# Altium project MiniGateway4G.PrjPcb
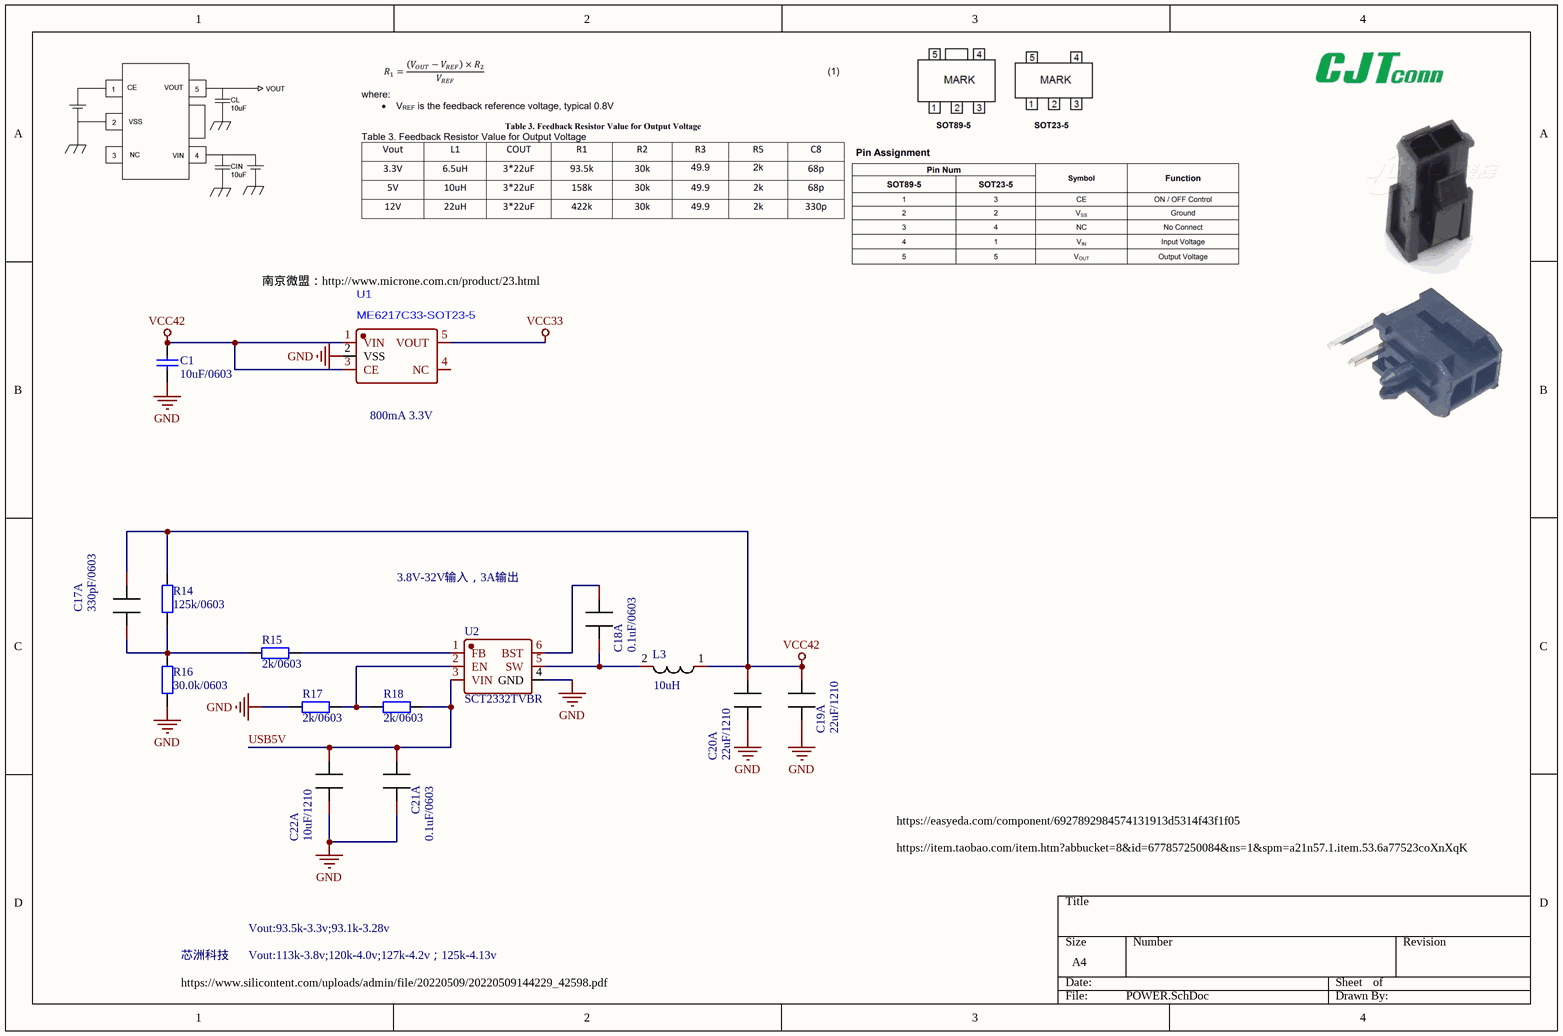
[diagram p0: POWER.SchDoc]
5 sheets, 71 parts. Net scope: global (net labels, ports and power ports of the same name join across sheets).
Board file: MiniGateway4G0409.PcbDoc
Sheets:
  POWER.SchDoc
  My4G.SchDoc
  RS485.SchDoc
  CANBUS.SchDoc
  MCU.SchDoc

## Sheet POWER.SchDoc
size A4; SheetNumber: 1; SheetTotal: 5

### Parts
C1  10uF/0603  [CAP0603]
C17  330pF/0603  [CAP0603]  (part A of 4)
C18  0.1uF/0603  [CAP0603]  (part A of 4)
C19  22uF/1210  [CAP0603]  (part A of 4)
C20  22uF/1210  [CAP1210-CAPC3225X140N]  (part A of 4)
C21  0.1uF/0603  [CAP0603]  (part A of 4)
C22  10uF/1210  [CAP1210-CAPC3225X140N]  (part A of 4)
L3  10uH  [IND-SMD_L4.7-W4.7-6.5uH]
R14  125k/0603  [RES0603]
R15  2k/0603  [RES0603]
R16  30.0k/0603  [RES0603]
R17  2k/0603  [RES0603]
R18  2k/0603  [RES0603]
U1  ME6217C33-SOT23-5  [ME6217C33-SOT23-5]
U2  SCT2332TVBR  [SCT2332TVBR-TSOT23-6]

### Nets
GND: C1.1 C19.2 C20.2 C21.2 C22.2 R16.2 R17.2 U1.2(VSS) U2.4(GND)
VCC33: U1.5(VOUT)
VCC42: C1.2 C17.1 C19.1 C20.1 L3.1 R14.1 U1.1(VIN) U1.3(CE)
USB5V: C21.1 C22.1 R18.1 U2.3(VIN)
NetC17_2: C17.2 R14.2 R15.2 R16.1
NetC18_1: C18.1 U2.6(BST)
NetC18_2: C18.2 L3.2 U2.5(SW)
NetR15_1: R15.1 U2.1(FB)
NetR17_1: R17.1 R18.2 U2.2(EN)

Not connected (* = marked no-connect by the designer): U1 4(NC)

### Notes on the sheet
- 南京微盟：http://www.microne.com.cn/product/23.html
- (near U1) 800mA 3.3V
- 3.8V-32V输入，3A输出
- https://item.taobao.com/item.htm?abbucket=8&id=677857250084&ns=1&spm=a21n57.1.item.53.6a77523coXnXqK
- https://easyeda.com/component/6927892984574131913d5314f43f1f05
- 芯洲科技
- https://www.silicontent.com/uploads/admin/file/20220509/20220509144229_42598.pdf
- Vout:113k-3.8v;120k-4.0v;127k-4.2v；125k-4.13v
- Vout:93.5k-3.3v;93.1k-3.28v

### Library data of the parts
C1 = Cap Semi: Capacitor (Semiconductor SIM Model); Value: 10uf; Published: 8-Jun-2000; LatestRevisionDate: 29-May-2009; LatestRevisionNote: IPC-7351 Footprint Added.; PackageReference: C1206; Publisher: Altium Limited; PackageDescription: Chip Capacitor
C17 = CAP0603: SURFACE MOUNT CAPACITOR 0.031 X 0.061 INCHES; Manufacturer #1: IPC SM-782 STD.; Sim_Analog_Order: Model$; Value: 330pF/0603/25V; PCB DECAL: 0603; Add into BOM: yes; Name: CAP0603; Symbol: CAP0603; Device: CAP0603; OldName: CAP0603; Convert to PCB: yes; Origin Footprint: 0603
C18 C19 C21 = CAP0603: SURFACE MOUNT CAPACITOR 0.031 X 0.061 INCHES; Manufacturer #1: IPC SM-782 STD.; Sim_Analog_Order: Model$; Value: 0.1uF/0603/50V; PCB DECAL: 0603; Add into BOM: yes; Name: CAP0603; Symbol: CAP0603; Device: CAP0603; OldName: CAP0603; Convert to PCB: yes; Origin Footprint: 0603
C20 = CAP0603: SURFACE MOUNT CAPACITOR 0.031 X 0.061 INCHES; Manufacturer #1: IPC SM-782 STD.; Sim_Analog_Order: Model$; Value: 22uF/1210/35V; PCB DECAL: 0603; Add into BOM: yes; Name: CAP0603; Symbol: CAP0603; Device: CAP0603; OldName: CAP0603; Convert to PCB: yes; Origin Footprint: 0603
C22 = CAP0603: SURFACE MOUNT CAPACITOR 0.031 X 0.061 INCHES; Manufacturer #1: IPC SM-782 STD.; Sim_Analog_Order: Model$; Value: 10uF/1210/35V; PCB DECAL: 0603; Add into BOM: yes; Name: CAP0603; Symbol: CAP0603; Device: CAP0603; OldName: CAP0603; Convert to PCB: yes; Origin Footprint: 0603
L3 = IND-MOLDED: 0503贴片电感; Sim_Analog_Order: Model$; Sim_Analog_Prefix: L; Description" MOLDED INDUCTOR, 0_5: PIN SPACING; PCB DECAL: L_0650; Add into BOM: yes; Name: IND-MOLDED; Symbol: IND-MOLDED; Device: IND-MOLDED; OldName: IND-MOLDED; Value: 10uH; Convert to PCB: yes; Origin Footprint: L_0650
R14-R18 = Res2: Resistor; Published: 8-Jun-2000; LatestRevisionDate: 17-Jul-2002; LatestRevisionNote: Re-released for DXP Platform.; PackageReference: AXIAL-0.4; Publisher: Altium Limited; PackageDescription: Axial Device, Thru-Hole; 2 Leads; 0.4 in Pin Spacing
U1 = ME6217C33M5G: 4.2v-3.3v LDO
U2 = SCT2332TVBR: 3.8V-32V Vin, 3A Synchronous Step-down DCDC Converter

## Sheet My4G.SchDoc
size A3; SheetNumber: 2; SheetTotal: 5
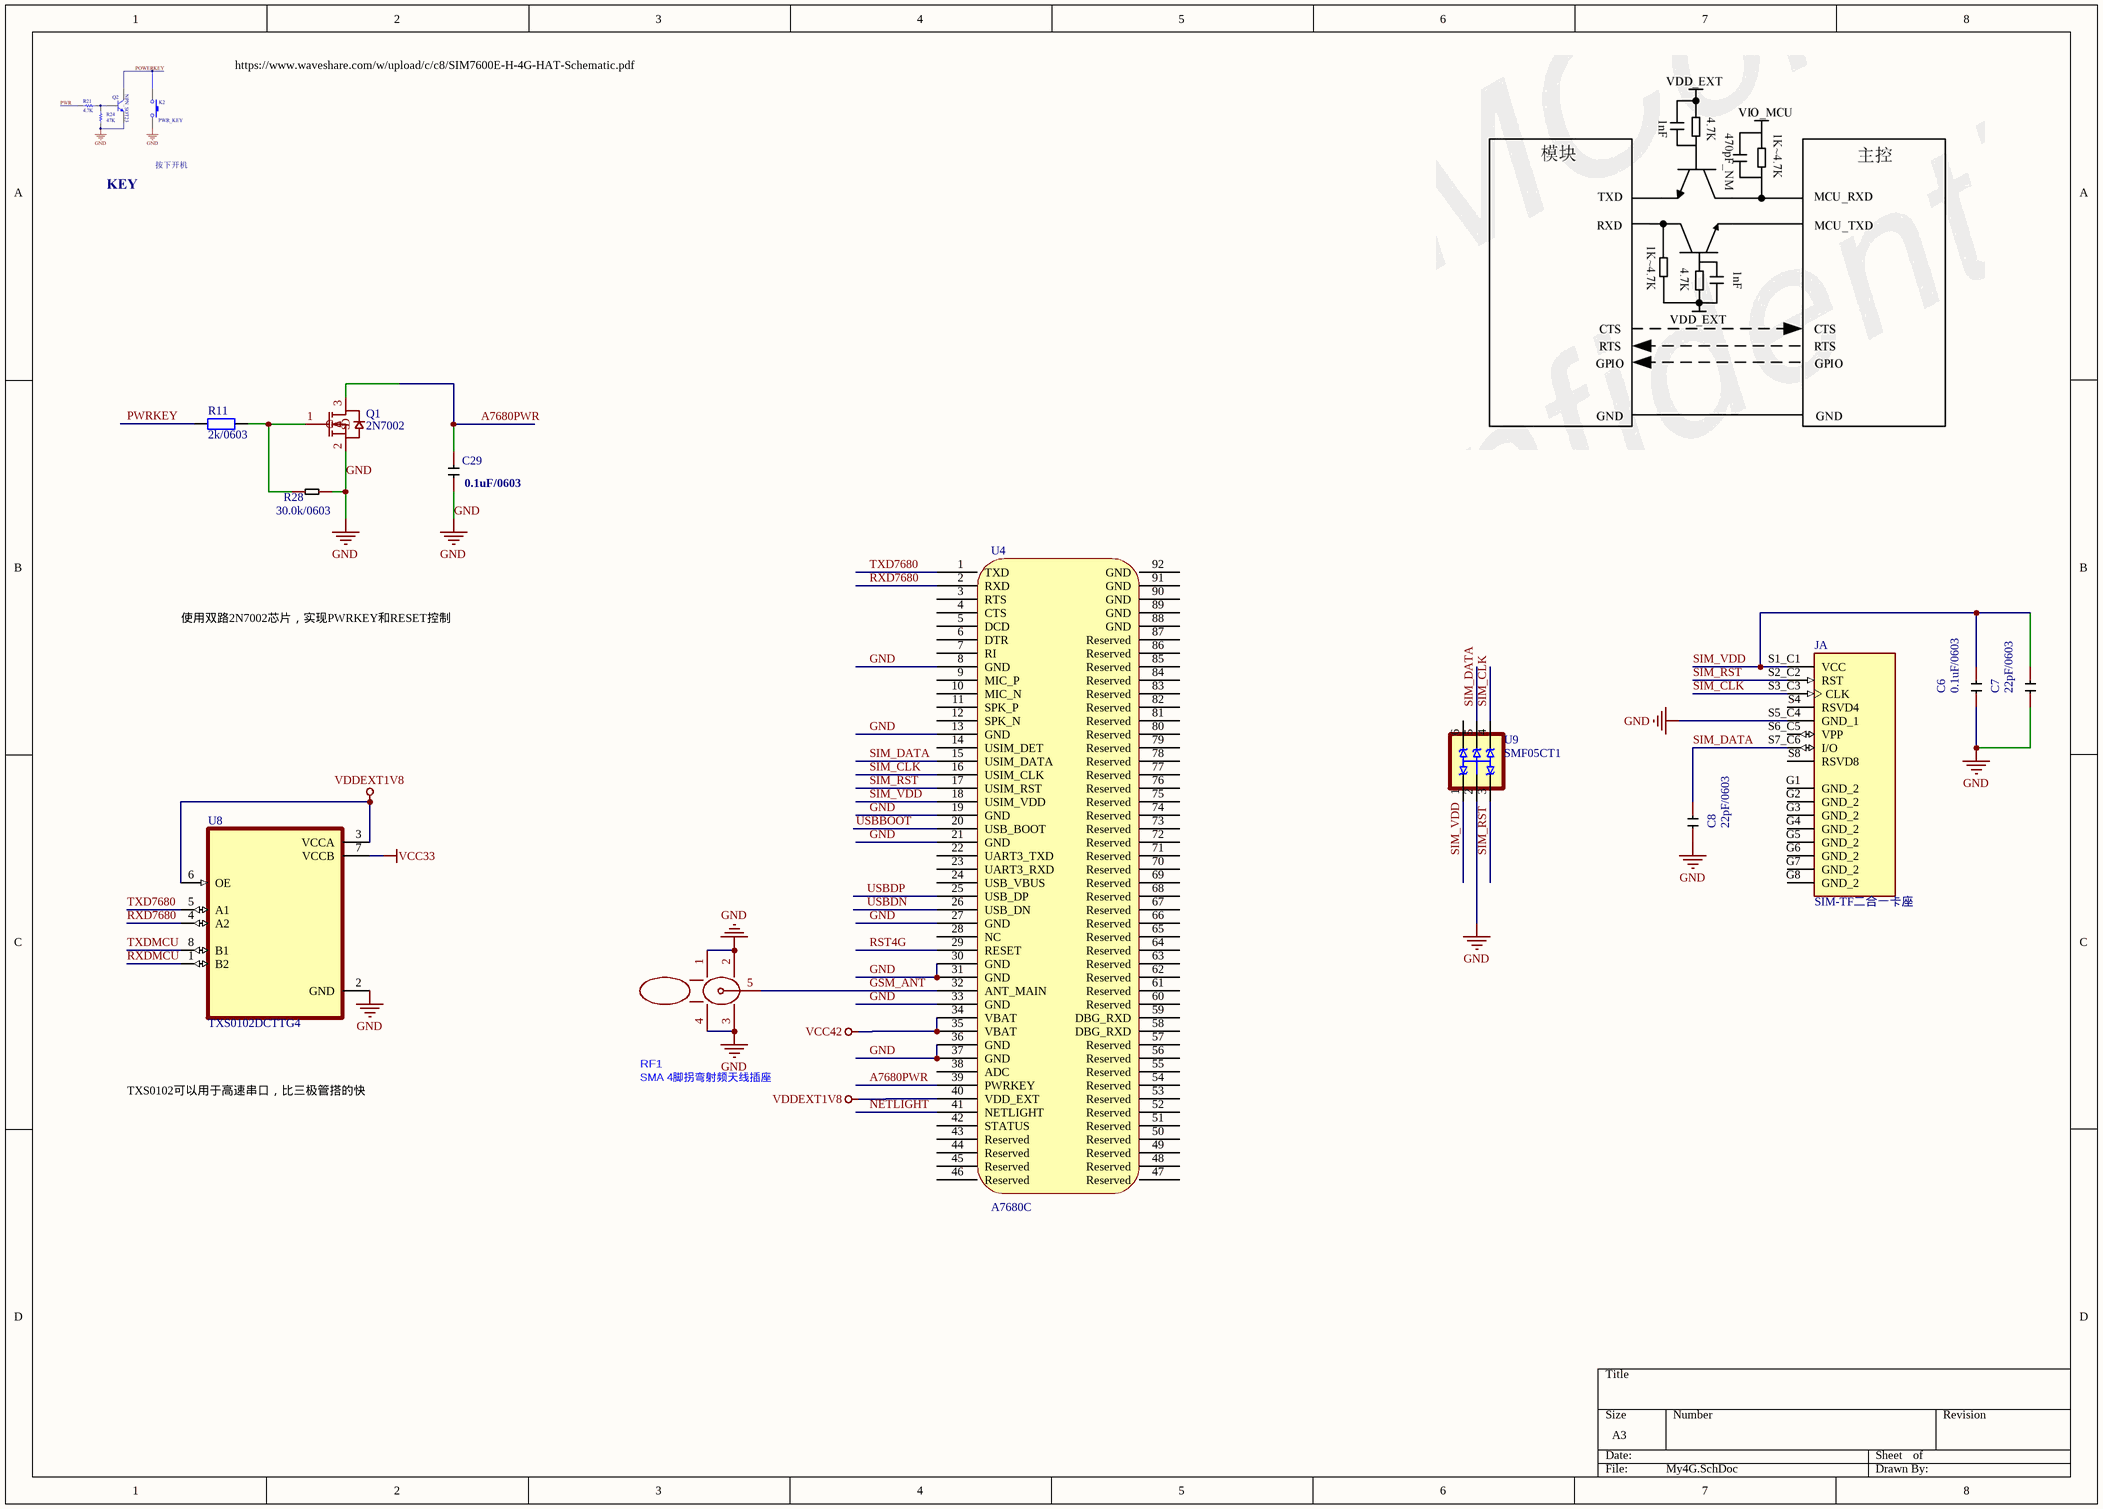
[diagram p1: My4G.SchDoc]

### Parts
C6  0.1uF/0603  [CAP0603]
C7  22pF/0603  [CAP0603]
C8  22pF/0603  [CAP0603]
C29  0.1uF/0603  [CAP0603]
J  SIM-TF二合一卡座  [MOLEX_104642-1610]  (part A of 2)
Q1  2N7002  [SOT-23_2N7002]
R11  2k/0603  [RES0603]
R28  30.0k/0603  [RES0603]
RF1  SMA 4脚拐弯射频天线插座  [SMA-TH_BWSMA-KWE-Z001]
U4  A7680C  [LCC-LAG_L17.6-W15.7_A7680C]
U8  TXS0102DCTTG4  [TXS0102]
U9  SMF05CT1  [SMF05C-SC706]

### Nets
GND: C6.1 C7.1 C8.1 C29.1 J.S5_C4(GND_1) Q1.2(S) R28.1 RF1.1 RF1.2 RF1.3 RF1.4 U4.8(GND) U4.13(GND) U4.19(GND) U4.21(GND) U4.27(GND) U4.30(GND) U4.31(GND) U4.33(GND) U4.36(GND) U4.37(GND) U8.2(GND) U9.2(A)
VCC33: U8.7(VCCB)
VCC42: U4.34(VBAT) U4.35(VBAT)
VDDEXT1V8: U4.40(VDD_EXT) U8.3(VCCA) U8.6(OE)
A7680PWR: C29.2 Q1.3(D) U4.39(PWRKEY)
GSM_ANT: RF1.5 U4.32(ANT_MAIN)
NETLIGHT: U4.41(NETLIGHT)
PWRKEY: R11.1
RST4G: U4.29(RESET)
RXD7680: U4.2(RXD) U8.4(A2)
RXDMCU: U8.1(B2)
SIM_CLK: J.S3_C3(CLK) U4.16(USIM_CLK) U9.4(C3)
SIM_DATA: C8.2 J.S7_C6(I/O) U4.15(USIM_DATA) U9.5(C4)
SIM_RST: J.S2_C2(RST) U4.17(USIM_RST) U9.3(C2)
SIM_VDD: C6.2 C7.2 J.S1_C1(VCC) U4.18(USIM_VDD) U9.1(C1)
TXD7680: U4.1(TXD) U8.5(A1)
TXDMCU: U8.8(B1)
USBBOOT: U4.20(USB_BOOT)
USBDN: U4.26(USB_DN)
USBDP: U4.25(USB_DP)
NetQ1_1: Q1.1(G) R11.2 R28.2

Not connected (* = marked no-connect by the designer): J G1(GND_2) G2(GND_2) G3(GND_2) G4(GND_2) G5(GND_2) G6(GND_2) G7(GND_2) G8(GND_2) S4(RSVD4) S6_C5(VPP) S8(RSVD8); U4 3(RTS) 4(CTS) 5(DCD) 6(DTR) 7(RI) 9(MIC_P) 10(MIC_N) 11(SPK_P) 12(SPK_N) 14(USIM_DET) 22(UART3_TXD) 23(UART3_RXD) 24(USB_VBUS) 28(NC) 38(ADC) 42(STATUS) 43(Reserved) 44(Reserved) 45(Reserved) 46(Reserved) 47(Reserved) 48(Reserved) 49(Reserved) 50(Reserved) 51(Reserved) 52(Reserved) 53(Reserved) 54(Reserved) 55(Reserved) 56(Reserved) 57(Reserved) 58(DBG_RXD) 59(DBG_RXD) 60(Reserved) 61(Reserved) 62(Reserved) 63(Reserved) 64(Reserved) 65(Reserved) 66(Reserved) 67(Reserved) 68(Reserved) 69(Reserved) 70(Reserved) 71(Reserved) 72(Reserved) 73(Reserved) 74(Reserved) 75(Reserved) 76(Reserved) 77(Reserved) 78(Reserved) 79(Reserved) 80(Reserved) 81(Reserved) 82(Reserved) 83(Reserved) 84(Reserved) 85(Reserved) 86(Reserved) 87(Reserved) 88(GND) 89(GND) 90(GND) 91(GND) 92(GND); U9 6(C5)

### Notes on the sheet
- https://www.waveshare.com/w/upload/c/c8/SIM7600E-H-4G-HAT-Schematic.pdf
- 使用双路2N7002芯片，实现PWRKEY和RESET控制
- TXS0102可以用于高速串口，比三极管搭的快

### Library data of the parts
C6 = Discrete_C*_-0603: Name: 0.1uF; Add into BOM: yes; Origin Footprint: 0603; Symbol: Discrete_C*_-0603; Device: Discrete_C*_-0603; Convert to PCB: yes
C7 = Discrete_C*_-0603: Name: 33pF; Add into BOM: yes; Origin Footprint: 0603; Symbol: Discrete_C*_-0603; Device: Discrete_C*_-0603; Convert to PCB: yes
C8 = Discrete_C*_-0603: Add into BOM: yes; Origin Footprint: 0603; Name: 22pF/0603; Symbol: Discrete_C*_-0603; Device: Discrete_C*_-0603; Convert to PCB: yes
C29 = Discrete_C*_-0603: Name: NC; Add into BOM: yes; Origin Footprint: 0603; Symbol: Discrete_C*_-0603; Device: Discrete_C*_-0603; Convert to PCB: yes
J = 104642-1610: 17 (16 + 1) Position Card Connector Combo - microSDâ„¢, Micro SIM Surface Mount, Right Angle Gold or Gold-Palladium; MF: Molex; Package: None; SnapEDA_Link: https://www.snapeda.com/parts/104642-1610/Molex/view-part/501052/?ref=snap; Mouser-Purchase-URL: https://snapeda.com/shop?store=Mouser&id=501052; MP: 104642-1610; Price: None; Availability: Warning; Value: *
Q1 = 2N7002: Nmos 2N7000, 2N7002, NDS7002A
R11 = Res2: Published: 8-Jun-2000; LatestRevisionDate: 17-Jul-2002; LatestRevisionNote: Re-released for DXP Platform.; PackageReference: AXIAL-0.4; Publisher: Altium Limited; PackageDescription: Axial Device, Thru-Hole; 2 Leads; 0.4 in Pin Spacing
R28 = Discrete_R*_-0603: Name: 47K/0603; Add into BOM: yes; Origin Footprint: R0603; Symbol: Discrete_R*_-0603; Device: Discrete_R*_-0603; Convert to PCB: yes
RF1 = BWSMA-KWE-Z001
U4 = A7680C-LAAS: 4G cat1 module
U8 = TXS0102DCTTG4: 2-Bit Bidirectional Voltage-Level Shifter for Open-Drain and Push-Pull Application 8-SM8 -40 to 85; MF: Texas Instruments; SnapEDA_Link: https://www.snapeda.com/parts/TXS0102DCTTG4/Texas+Instruments/view-part/?ref=snap; Package: SSOP-8 Texas Instruments; Value: *; MP: TXS0102DCTTG4; Check_prices: https://www.snapeda.com/parts/TXS0102DCTTG4/Texas+Instruments/view-part/?ref=eda
U9 = SMF05CT1: 12.5V Clamp 8A (8/20Âµs) Ipp Tvs Diode Surface Mount SC-88/SC70-6/SOT-363; MF: ON Semiconductor; Availability: In Stock; Package: SOT-363 ON Semiconductor; MP: SMF05CT1; Value: *; SnapEDA_Link: https://www.snapeda.com/parts/SMF05CT1/Onsemi/view-part/?ref=snap; Price: None; Purchase-URL: https://pricing.snapeda.com/search/part/SMF05CT1/?ref=eda; Check_prices: https://www.snapeda.com/parts/SMF05CT1/Onsemi/view-part/?ref=eda

## Sheet RS485.SchDoc
size A4; SheetNumber: 3; SheetTotal: 5
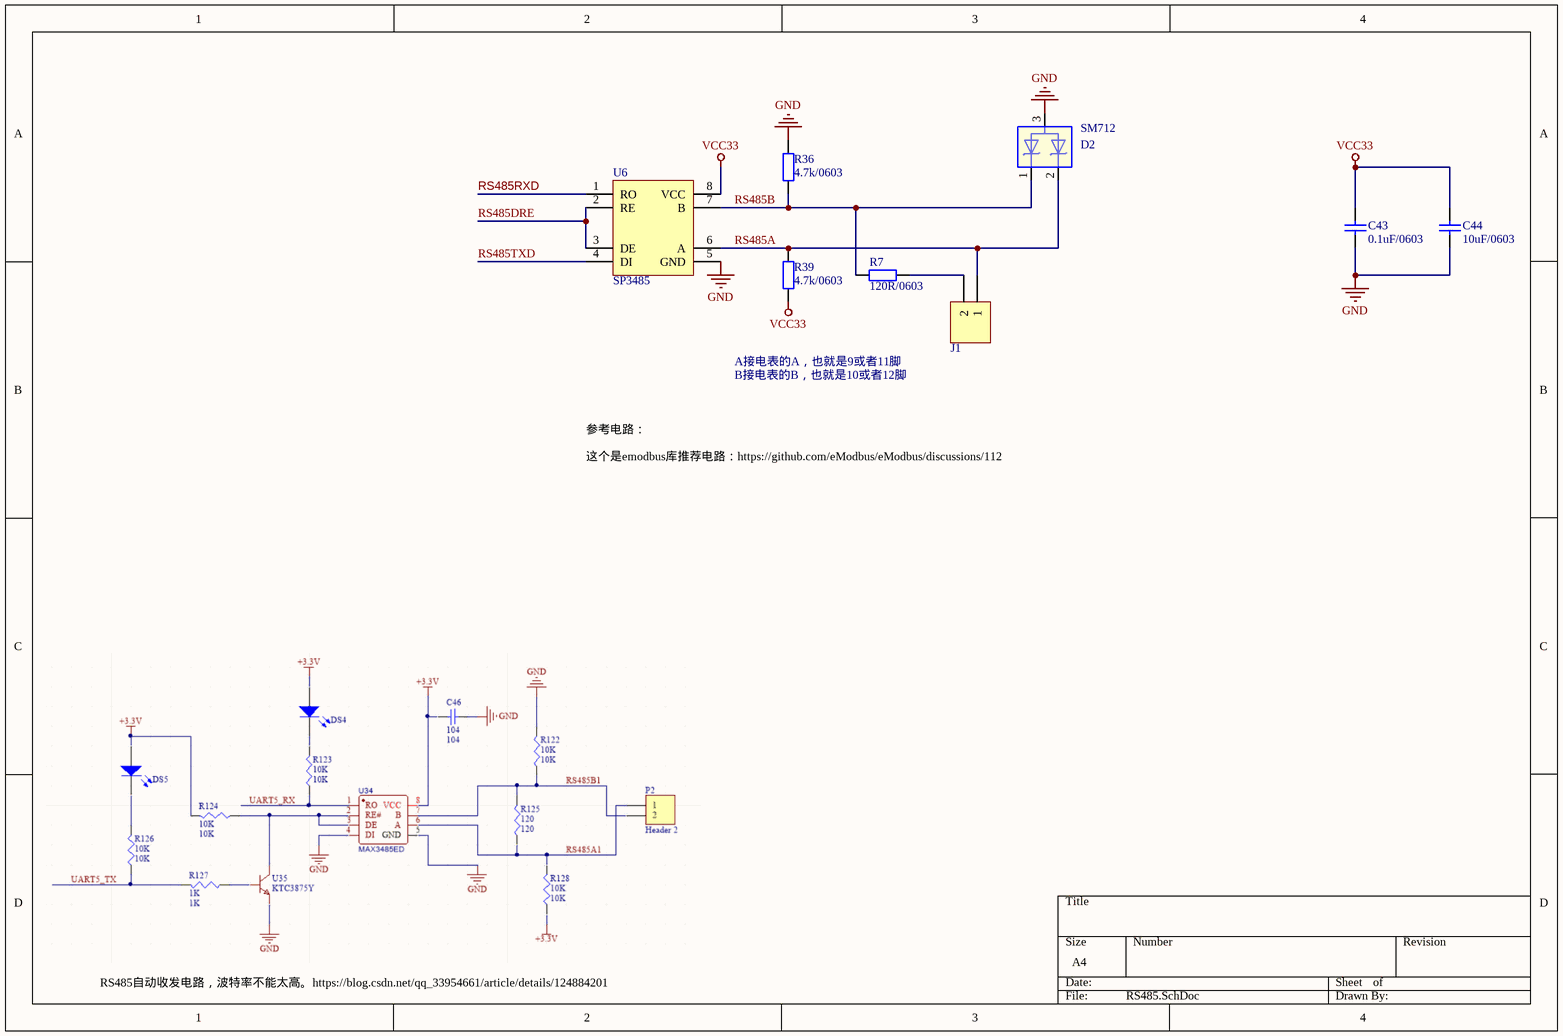
[diagram p2: RS485.SchDoc]

### Parts
C43  0.1uF/0603  [CAP0603]
C44  10uF/0603  [CAP0603]
D2  SM712  [SOT95P280X135-3N]
J1  Jumper  [HDR1X2]  (value not drawn)
R7  120R/0603  [RES0603]
R36  4.7k/0603  [RES0603]
R39  4.7k/0603  [RES0603]
U6  SP3485  [SP3485-SOP8]

### Nets
GND: C43.1 C44.1 D2.3 R36.1 U6.5(GND)
VCC33: C43.2 C44.2 R39.2 U6.8(VCC)
RS485A: D2.2 J1.1 R39.1 U6.6(A)
RS485B: D2.1 R7.1 R36.2 U6.7(B)
RS485DRE: U6.2(RE) U6.3(DE)
RS485RXD: U6.1(RO)
RS485TXD: U6.4(DI)
NetJ1_2: J1.2 R7.2

### Notes on the sheet
- A接电表的A，也就是9或者11脚
- B接电表的B，也就是10或者12脚
- 参考电路：https://components101.com/ics/sp3485-half-duplex-rs485-transceiver-ic
- 这个是emodbus库推荐电路：https://github.com/eModbus/eModbus/discussions/112
- RS485自动收发电路，波特率不能太高。https://blog.csdn.net/qq_33954661/article/details/124884201

### Library data of the parts
C43 = Cap Semi: Capacitor (Semiconductor SIM Model); Value: 100pF; Published: 8-Jun-2000; LatestRevisionDate: 29-May-2009; LatestRevisionNote: IPC-7351 Footprint Added.; PackageReference: C1206; Publisher: Altium Limited; PackageDescription: Chip Capacitor
C44 = Cap Semi: as C1 on sheet POWER; Published: 8-Jun-2000; LatestRevisionDate: 29-May-2009; LatestRevisionNote: IPC-7351 Footprint Added.; PackageReference: C1206; Publisher: Altium Limited; PackageDescription: Chip Capacitor
D2 = SM05_D24: 兩路TVS二极管阵列; Part Number: 702112964; Origin: Altium; Design: 3; PCB Footprint: SOT95P280X135-3N
J1 = Header 2: Header, 2-Pin; LatestRevisionDate: 17-Jul-2002; LatestRevisionNote: Re-released for DXP Platform.; Publisher: Altium Limited
R7 = Res2: Resistor; Published: 8-Jun-2000; LatestRevisionDate: 17-Jul-2002; LatestRevisionNote: Re-released for DXP Platform.; PackageReference: AXIAL-0.4; Publisher: Altium Limited; PackageDescription: Axial Device, Thru-Hole; 2 Leads; 0.4 in Pin Spacing
R36 R39 = Res2: Published: 8-Jun-2000; LatestRevisionDate: 17-Jul-2002; LatestRevisionNote: Re-released for DXP Platform.; PackageReference: AXIAL-0.4; Publisher: Altium Limited; PackageDescription: Axial Device, Thru-Hole; 2 Leads; 0.4 in Pin Spacing
U6 = SP3485: 485总线芯片

## Sheet CANBUS.SchDoc
size A4; SheetNumber: 4; SheetTotal: 5
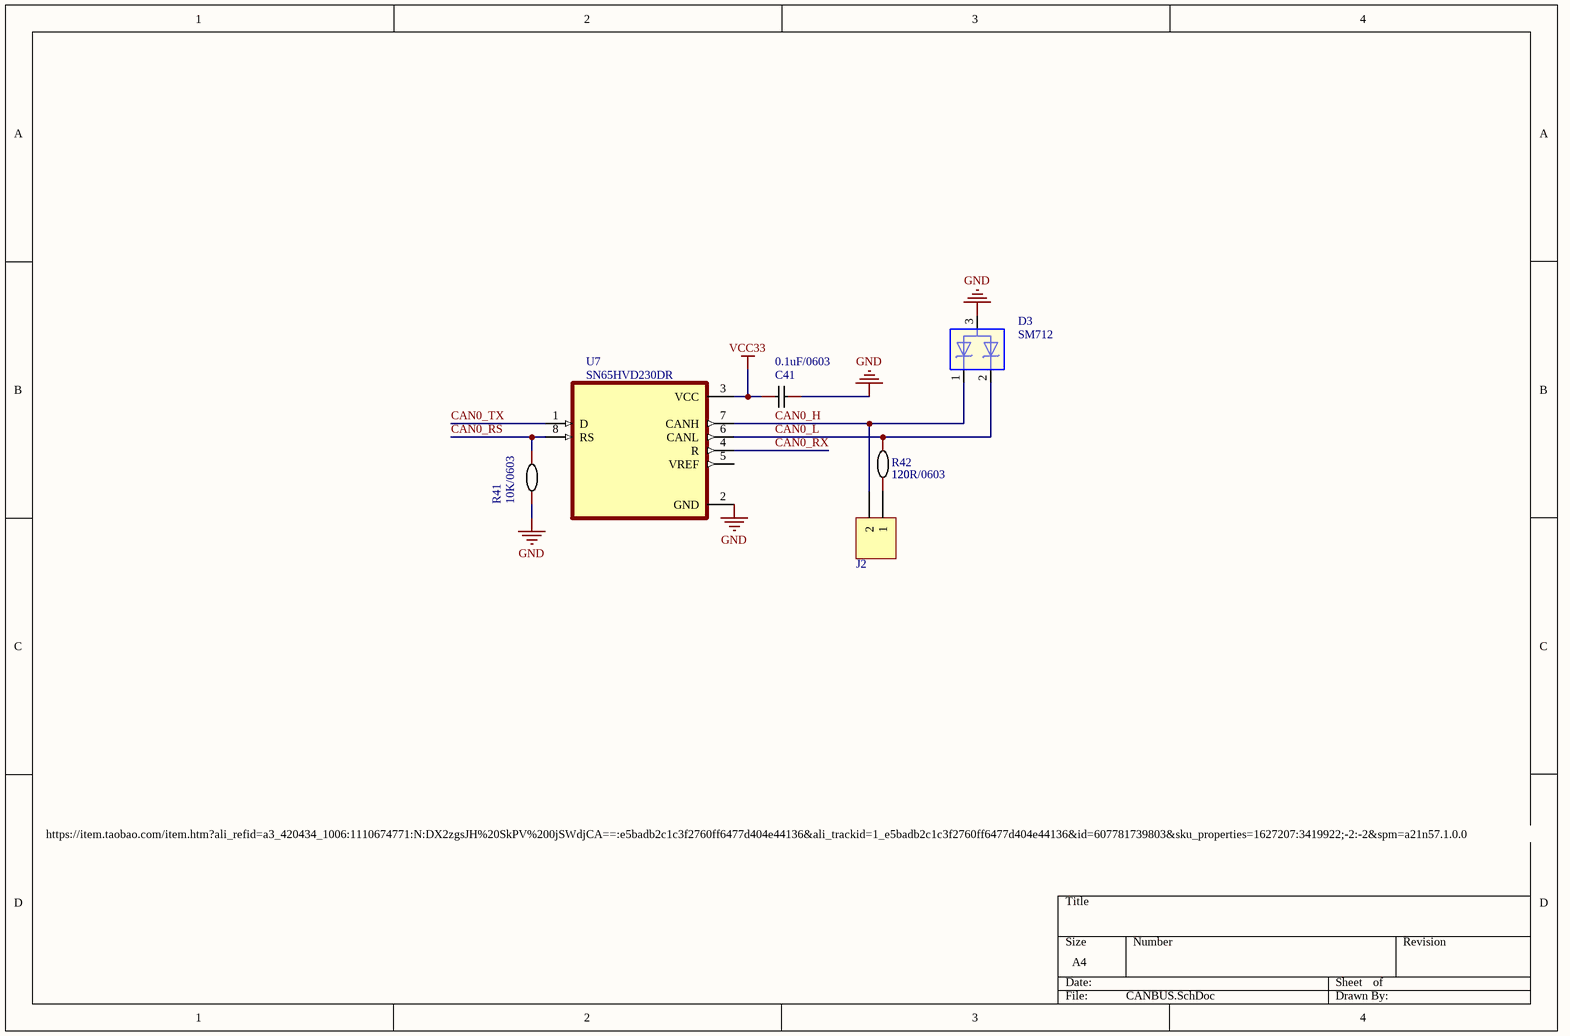
[diagram p3: CANBUS.SchDoc]

### Parts
C41  0.1uF/0603  [CAP0603]
D3  SM712  [SOT95P280X135-3N]
J2  Jumper  [HDR1X2]  (value not drawn)
R41  10K/0603  [RES0603]
R42  120R/0603  [RES0603]
U7  SN65HVD230DR  [SN65HVD230DR]

### Nets
GND: C41.1 D3.3 R41.1 U7.2(GND)
VCC33: C41.2 U7.3(VCC)
CAN0_H: D3.1 J2.2 U7.7(CANH)
CAN0_L: D3.2 R42.1 U7.6(CANL)
CAN0_RS: R41.2 U7.8(RS)
CAN0_RX: U7.4(R)
CAN0_TX: U7.1(D)
NetJ2_1: J2.1 R42.2

Not connected (* = marked no-connect by the designer): U7 5(VREF)

### Notes on the sheet
- https://item.taobao.com/item.htm?ali_refid=a3_420434_1006:1110674771:N:DX2zgsJH%20SkPV%200jSWdjCA==:e5badb2c1c3f2760ff6477d404e44136&ali_trackid=1_e5badb2c1c3f2760ff6477d404e44136&id=607781739803&sku_properties=1627207:3419922;-2:-2&spm=a21n57.1.0.0

### Library data of the parts
C41 = 100nF: Manufacturer Part: CL05B104KO5NNNC; Manufacturer: SAMSUNG; Convert to PCB: yes; Origin Footprint: C0402_NEW; Name: 100nF; Symbol: 100nF; Device: 100nF; Supplier: LCSC; Supplier Part: C1525; JLCPCB Part Class: Basic Part; Add into BOM: yes
D3 = SM05_D24: as D2 on sheet RS485; PCB Footprint: SOT95P280X135-3N
J2 = Header 2: Header, 2-Pin; LatestRevisionDate: 17-Jul-2002; LatestRevisionNote: Re-released for DXP Platform.; Publisher: Altium Limited
R41 = 10K: Manufacturer: UniOhm; Manufacturer Part: 0402WGF1002TCE; Convert to PCB: yes; Origin Footprint: R0402; Name: 10K; Symbol: 10K; Device: 10K; Supplier: LCSC; Supplier Part: C25744; JLCPCB Part Class: Basic Part; Add into BOM: yes
R42 = 120: Manufacturer: RALEC; Manufacturer Part: RTT061200FTP; Convert to PCB: yes; Origin Footprint: R1206; Name: 120; Symbol: 120; Device: 120; Supplier: LCSC; Supplier Part: C159715; JLCPCB Part Class: Extended Part; Add into BOM: yes
U7 = SN65HVD230DR: 3.3 V CAN Transceiver with Standby Mode; MF: Texas Instruments; Availability: In Stock; SnapEDA_Link: https://www.snapeda.com/parts/SN65HVD230DR/Texas+Instruments/view-part/?ref=snap; Price: None; Check_prices: https://www.snapeda.com/parts/SN65HVD230DR/Texas+Instruments/view-part/?ref=eda; Package: SOIC-8 Texas Instruments; MP: SN65HVD230DR; Value: *; Purchase-URL: https://pricing.snapeda.com/search/part/SN65HVD230DR/?ref=eda

## Sheet MCU.SchDoc
size A2; SheetNumber: 5; SheetTotal: 5; SPICEModelCacheQAHRCPJZ: <root> / <DocumentId>QAHRCPJZ</DocumentId> / </root>
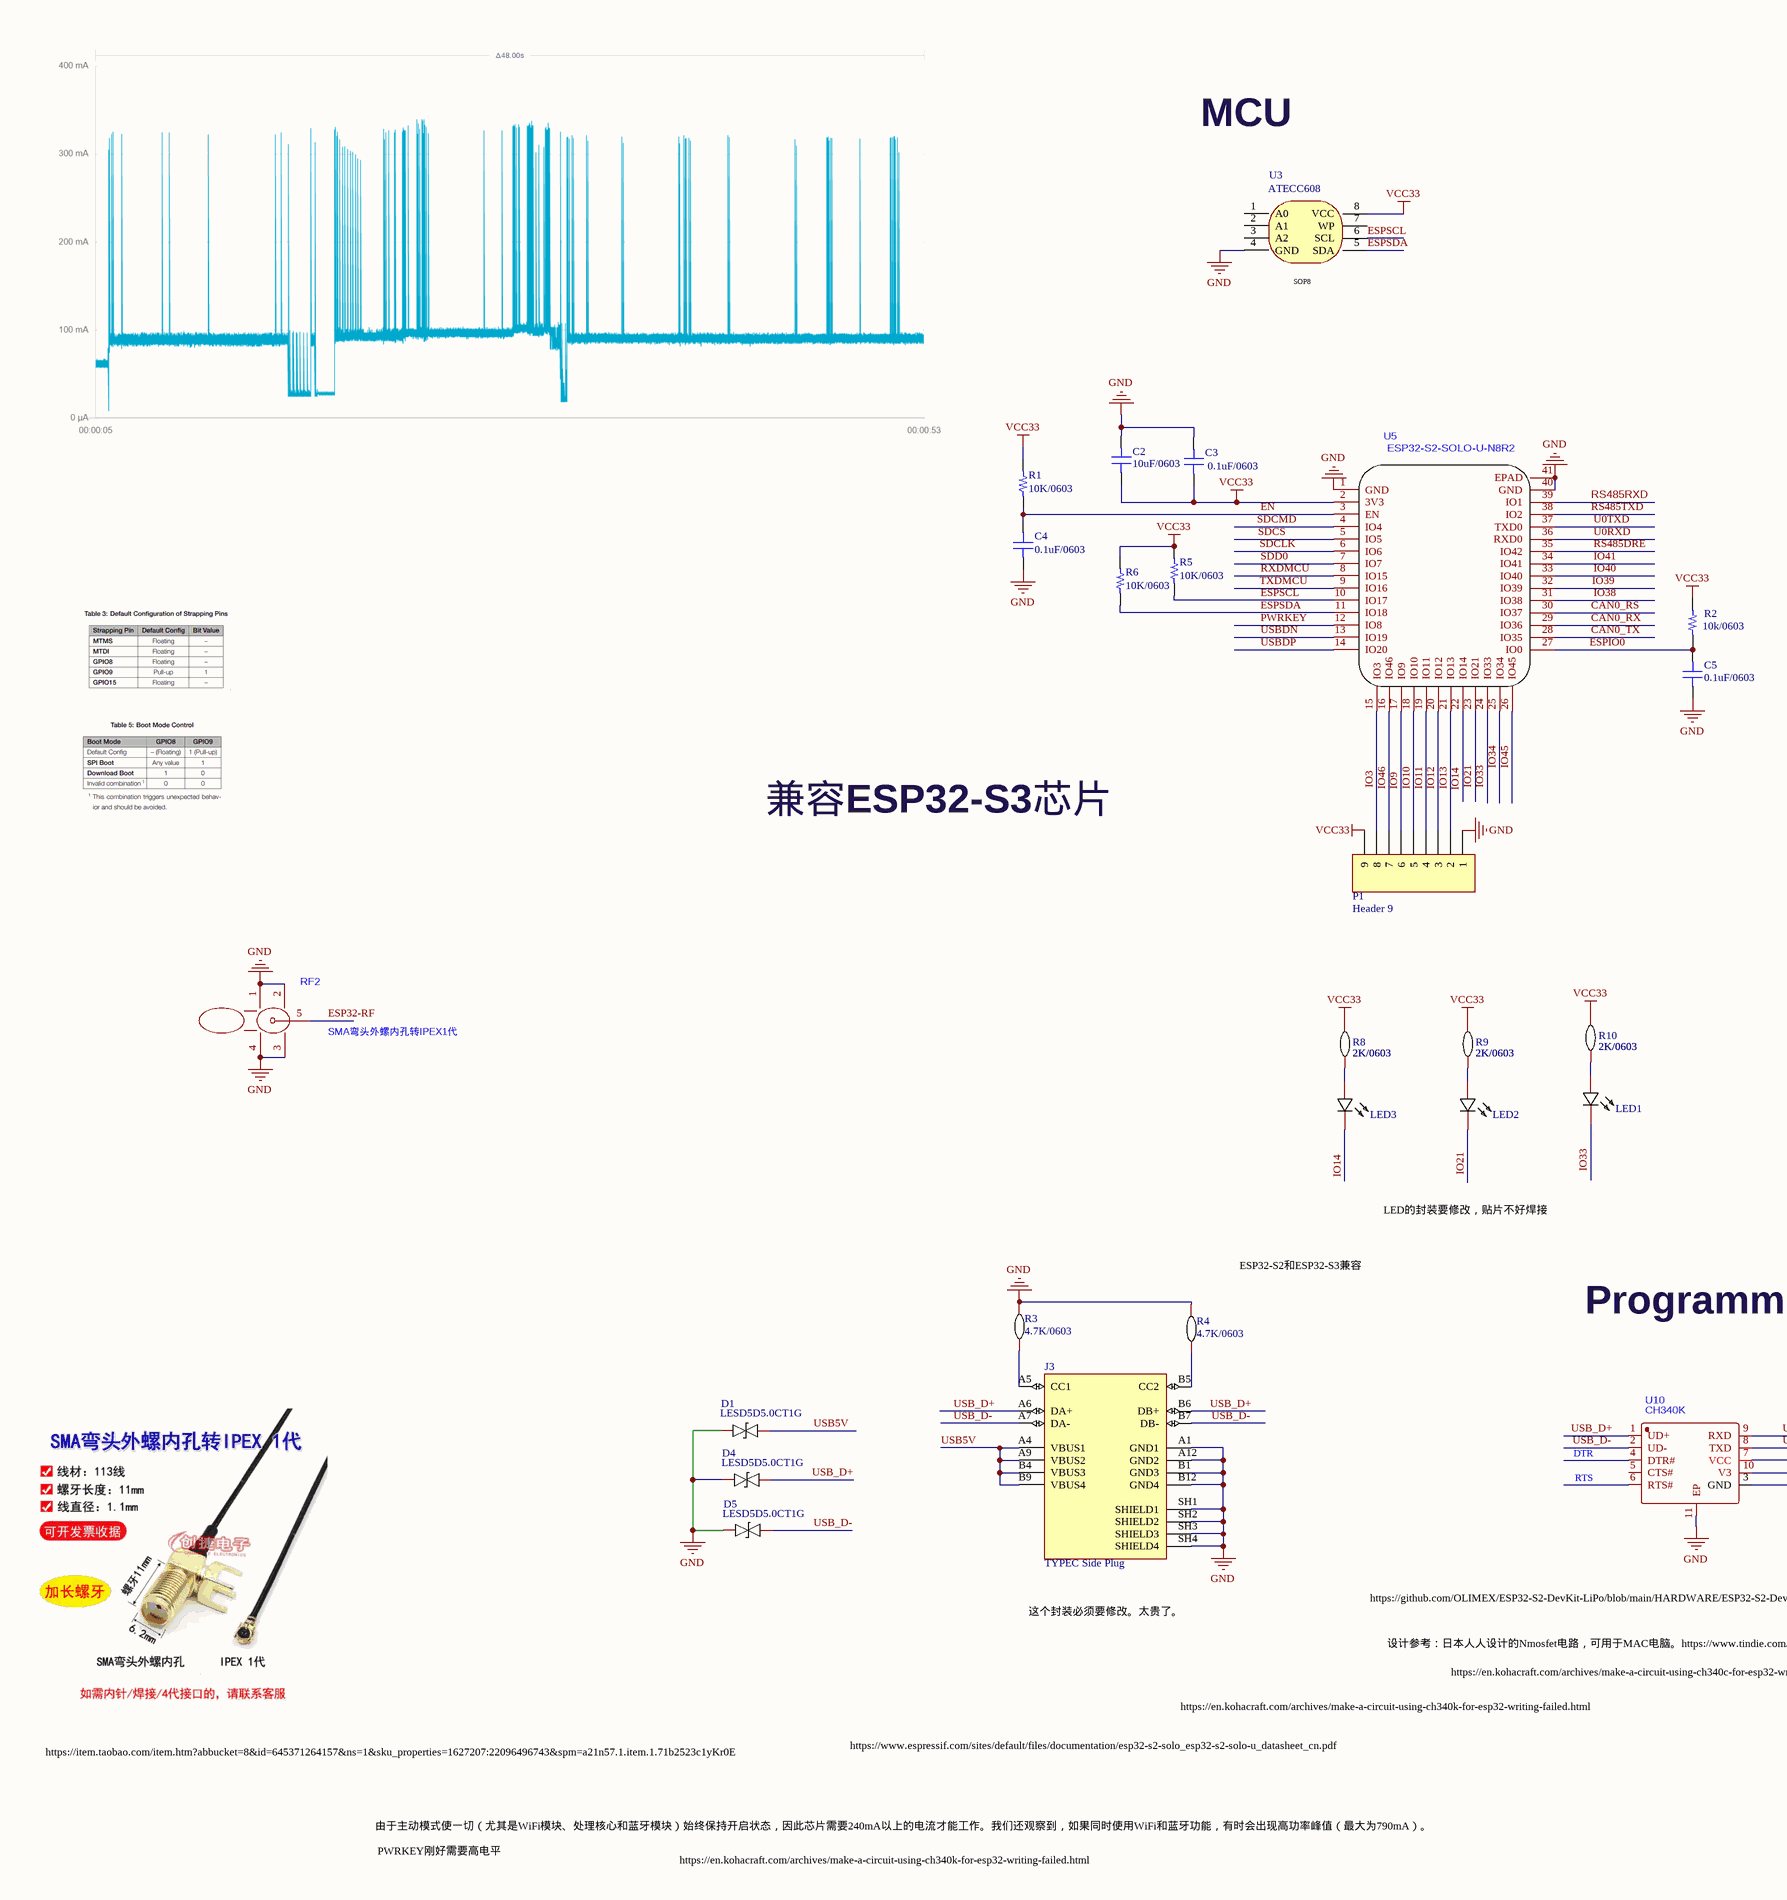
[diagram p4: MCU.SchDoc, left]
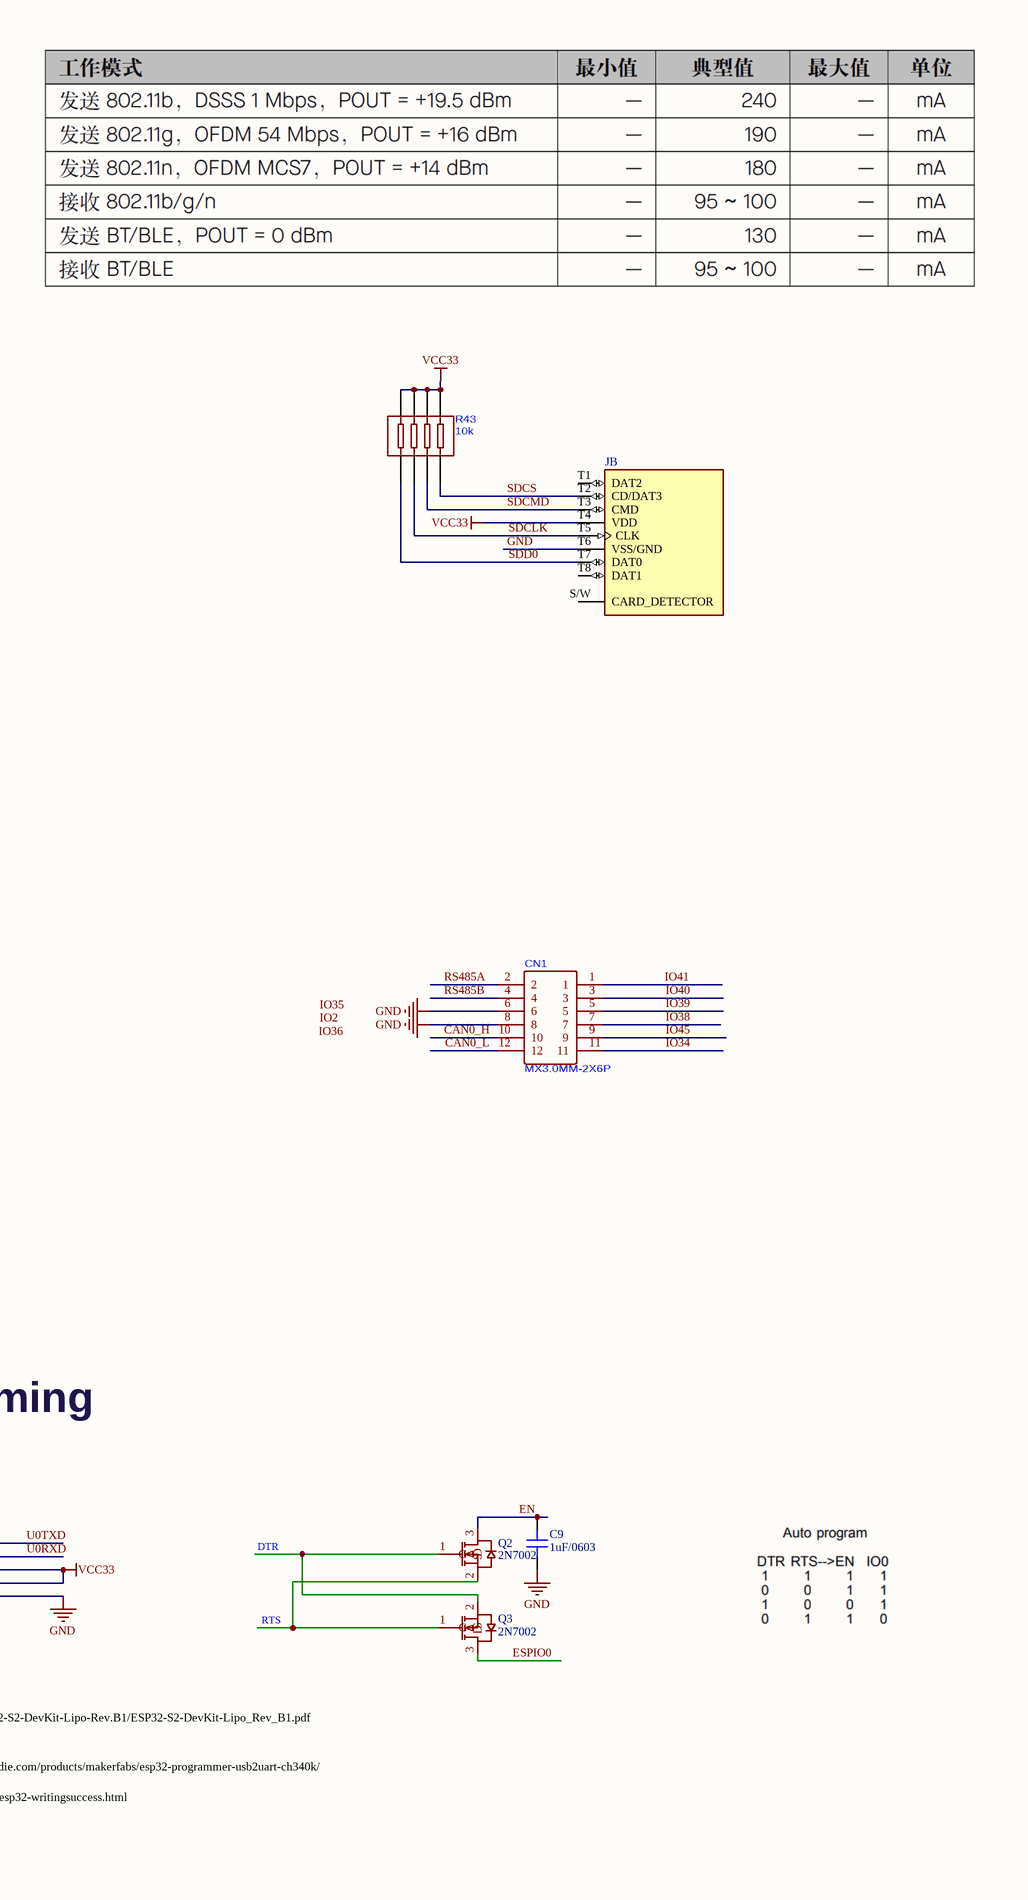
[diagram p5: MCU.SchDoc, right]

### Parts
C2  10uF/0603  [CAP0603]
C3  0.1uF/0603  [CAp0603]
C4  0.1uF/0603  [CAP0603]
C5  0.1uF/0603  [CAP0603]
C9  1uF/0603  [CAP0603]
CN1  MX3.0MM-2X6P  [3.0MM-2X6P]
D1  LESD5D5.0CT1G  [LESD5D5.0CT1G-SOD-523]
D4  LESD5D5.0CT1G  [LESD5D5.0CT1G-SOD-523]
D5  LESD5D5.0CT1G  [LESD5D5.0CT1G-SOD-523]
J  104642-1610  [MOLEX_104642-1610]  (value not drawn)  (part B of 2)
J3  TYPEC Side Plug  [TYPE-C side plug]
LED1  0603LED-红  [LED_0603_KA]  (value not drawn)
LED2  0603LED-红  [LED_0603_KA]  (value not drawn)
LED3  0603LED-红  [LED_0603_KA]  (value not drawn)
P1  Header 9  [HDR1X9]
Q2  2N7002  [SOT-23_2N7002]
Q3  2N7002  [SOT-23_2N7002]
R1  10K/0603  [RES0603]
R2  10k/0603  [RES0603]
R3  4.7K/0603  [RES0603]
R4  4.7K/0603  [RES0603]
R5  10K/0603  [RES0603]
R6  10K/0603  [RES0603]
R8  2K/0603  [RES0603]
R9  2K/0603  [RES0603]
R10  2K/0603  [RES0603]
R43  10k  [RES-ARRAY-SMD_8P-L3.2-W1.6-P0.80-BL]
RF2  SMA弯头外螺内孔转IPEX1代  [SMA-TH_BWSMA-KWE-Z001]
U3  ATECC608  [SOIC127P600X175-8N - duplicate]
U5  ESP32-S2-SOLO-U-N8R2  [ESP32-S2-SOLO-U]
U10  CH340K  [ESOP-10_L4.9-W3.9-P1.00-LS6.2-BL-EP CH340K]

### Nets
GND: C2.1 C3.1 C4.1 C5.1 C9.1 CN1.6 CN1.8 D1.2 D4.2 D5.2 J.T6(VSS/GND) J3.A1(GND1) J3.A12(GND2) J3.B1(GND3) J3.B12(GND4) J3.SH1(SHIELD1) J3.SH2(SHIELD2) J3.SH3(SHIELD3) J3.SH4(SHIELD4) P1.1 R3.1 R4.1 RF2.1 RF2.2 RF2.3 RF2.4 U3.4(GND) U5.1(GND) U5.40(GND) U5.41(EPAD) U10.3(GND) U10.11(EP)
VCC33: C2.2 C3.2 J.T4(VDD) P1.9 R1.2 R2.2 R5.2 R6.2 R8.1 R9.1 R10.1 R43.5 R43.6 R43.7 R43.8 U3.8(VCC) U5.2(3V3) U10.7(VCC) U10.10(V3)
CAN0_H: CN1.10
CAN0_L: CN1.12
CAN0_RS: U5.30(IO37)
CAN0_RX: U5.29(IO36)
CAN0_TX: U5.28(IO35)
DTR: Q2.1(G) Q3.2(S) U10.4(DTR#)
EN: C4.2 C9.2 Q2.3(D) R1.1 U5.3(EN)
ESP32-RF: RF2.5
ESPIO0: C5.2 Q3.3(D) R2.1 U5.27(IO0)
ESPSCL: R5.1 U3.6(SCL) U5.10(IO17)
ESPSDA: R6.1 U3.5(SDA) U5.11(IO18)
IO3: P1.8 U5.15(IO3)
IO9: P1.6 U5.17(IO9)
IO10: P1.5 U5.18(IO10)
IO11: P1.4 U5.19(IO11)
IO12: P1.3 U5.20(IO12)
IO13: P1.2 U5.21(IO13)
IO14: LED3.2(C) U5.22(IO14)
IO21: LED2.2(C) U5.23(IO21)
IO33: LED1.2(C) U5.24(IO33)
IO34: CN1.11 U5.25(IO34)
IO38: CN1.7 U5.31(IO38)
IO39: CN1.5 U5.32(IO39)
IO40: CN1.3 U5.33(IO40)
IO41: CN1.1 U5.34(IO41)
IO45: CN1.9 U5.26(IO45)
IO46: P1.7 U5.16(IO46)
PWRKEY: U5.12(IO8)
RS485A: CN1.2
RS485B: CN1.4
RS485DRE: U5.35(IO42)
RS485RXD: U5.39(IO1)
RS485TXD: U5.38(IO2)
RTS: Q2.2(S) Q3.1(G) U10.6(RTS#)
RXDMCU: U5.8(IO15)
SDCLK: J.T5(CLK) R43.3 U5.6(IO6)
SDCMD: J.T3(CMD) R43.2 U5.4(IO4)
SDCS: J.T2(CD/DAT3) R43.1 U5.5(IO5)
SDD0: J.T7(DAT0) R43.4 U5.7(IO7)
TXDMCU: U5.9(IO16)
U0RXD: U5.36(RXD0) U10.8(TXD)
U0TXD: U5.37(TXD0) U10.9(RXD)
USB5V: D1.1 J3.A4(VBUS1) J3.A9(VBUS2) J3.B4(VBUS3) J3.B9(VBUS4)
USB_D+: D4.1 J3.A6(DA+) J3.B6(DB+) U10.1(UD+)
USB_D-: D5.1 J3.A7(DA-) J3.B7(DB-) U10.2(UD-)
USBDN: U5.13(IO19)
USBDP: U5.14(IO20)
NetJ3_A5: J3.A5(CC1) R3.2
NetJ3_B5: J3.B5(CC2) R4.2
NetLED1_1: LED1.1(A) R10.2
NetLED2_1: LED2.1(A) R9.2
NetLED3_1: LED3.1(A) R8.2

Not connected (* = marked no-connect by the designer): J S/W(CARD_DETECTOR) T1(DAT2) T8(DAT1); U3 1(A0) 2(A1) 3(A2) 7(WP); U10 5(CTS#)

### Notes on the sheet
- MCU
- (near U3) SOP8
- 兼容ESP32-S3芯片
- ESP32-S2和ESP32-S3兼容
- LED的封装要修改，贴片不好焊接
- Programming
- 这个封装必须要修改。太贵了。
- https://github.com/OLIMEX/ESP32-S2-DevKit-LiPo/blob/main/HARDWARE/ESP32-S2-DevKit-Lipo-Rev.B1/ESP32-S2-DevKit-Lipo_Rev_B1.pdf
- 设计参考：日本人人设计的Nmosfet电路，可用于MAC电脑。https://www.tindie.com/products/makerfabs/esp32-programmer-usb2uart-ch340k/
- https://en.kohacraft.com/archives/make-a-circuit-using-ch340c-for-esp32-writingsuccess.html
- https://item.taobao.com/item.htm?abbucket=8&id=645371264157&ns=1&sku_properties=1627207:22096496743&spm=a21n57.1.item.1.71b2523c1yKr0E
- https://www.espressif.com/sites/default/files/documentation/esp32-s2-solo_esp32-s2-solo-u_datasheet_cn.pdf
- https://en.kohacraft.com/archives/make-a-circuit-using-ch340k-for-esp32-writing-failed.html
- 由于主动模式使一切（尤其是WiFi模块、处理核心和蓝牙模块）始终保持开启状态，因此芯片需要240mA以上的电流才能工作。我们还观察到，如果同时使用WiFi和蓝牙功能，有时会出现高功率峰值（最大为790mA）。
- PWRKEY刚好需要高电平
- Labels drawn without touching a wire or pin: IO2, IO35, IO36

### Library data of the parts
C2 = C0805C220J5RAC7800: CAP CER SMD 0805 22PF 5% 50V X7R; Manufacturer: KEMET; Part Number: C0805C220J5RAC7800; Value: 10uF/0603; Applications: Bypass, Decoupling; Capacitance: 22pF; ComponentLink1Description: Datasheet; ComponentLink1URL: https://api.kemet.com/component-edge/download/datasheet/C0805C220J5RAC7800.pdf; ComponentLink2Description: DigiKey Link; ComponentLink2URL: http://digikey.com/product-detail/en/kemet/C0805C220J5RAC7800/399-17625-1-ND/8572625; Device Package: 0805 (2012 Metric); LastUpdated: 02.09.2020 01:04:09; Lifecycle Status: Active; Minimum Order: 1; Mounting Type: Surface Mount, MLCC; Operating Temperature: -55°C ~ 125°C; Package / Case: 0805 (2012 Metric); Packaging: TapeAndReel; PartId: 17442; Part Status: Active; Price: 0.03; Series: SMD Comm X7R; Size / Dimension: 0.079" L x 0.049" W (2.00mm x 1.25mm); Supplier 1: DigiKey; Supplier Part Number 1: 399-17625-1-ND; Temperature Coefficient: X7R; Thickness (Max): 0.035" (0.88mm); Tolerance: ±5%; Voltage - Rated: 50V
C3 = C0805C220J5RAC7800: CAP CER SMD 0805 22PF 5% 50V X7R; Manufacturer: KEMET; Value: 0.22uF/0603; Part Number: C0805C220J5RAC7800; Applications: Bypass, Decoupling; Capacitance: 22pF; ComponentLink1Description: Datasheet; ComponentLink1URL: https://api.kemet.com/component-edge/download/datasheet/C0805C220J5RAC7800.pdf; ComponentLink2Description: DigiKey Link; ComponentLink2URL: http://digikey.com/product-detail/en/kemet/C0805C220J5RAC7800/399-17625-1-ND/8572625; Device Package: 0805 (2012 Metric); LastUpdated: 02.09.2020 01:04:09; Lifecycle Status: Active; Minimum Order: 1; Mounting Type: Surface Mount, MLCC; Operating Temperature: -55°C ~ 125°C; Package / Case: 0805 (2012 Metric); Packaging: TapeAndReel; PartId: 17442; Part Status: Active; Price: 0.03; Series: SMD Comm X7R; Size / Dimension: 0.079" L x 0.049" W (2.00mm x 1.25mm); Supplier 1: DigiKey; Supplier Part Number 1: 399-17625-1-ND; Temperature Coefficient: X7R; Thickness (Max): 0.035" (0.88mm); Tolerance: ±5%; Voltage - Rated: 50V
C4 C5 C9 = C0805C220J5RAC7800: CAP CER SMD 0805 22PF 5% 50V X7R; Manufacturer: KEMET; Value: 0.1uF; Part Number: C0805C220J5RAC7800; Applications: Bypass, Decoupling; Capacitance: 22pF; ComponentLink1Description: Datasheet; ComponentLink1URL: https://api.kemet.com/component-edge/download/datasheet/C0805C220J5RAC7800.pdf; ComponentLink2Description: DigiKey Link; ComponentLink2URL: http://digikey.com/product-detail/en/kemet/C0805C220J5RAC7800/399-17625-1-ND/8572625; Device Package: 0805 (2012 Metric); LastUpdated: 02.09.2020 01:04:09; Lifecycle Status: Active; Minimum Order: 1; Mounting Type: Surface Mount, MLCC; Operating Temperature: -55°C ~ 125°C; Package / Case: 0805 (2012 Metric); Packaging: TapeAndReel; PartId: 17442; Part Status: Active; Price: 0.03; Series: SMD Comm X7R; Size / Dimension: 0.079" L x 0.049" W (2.00mm x 1.25mm); Supplier 1: DigiKey; Supplier Part Number 1: 399-17625-1-ND; Temperature Coefficient: X7R; Thickness (Max): 0.035" (0.88mm); Tolerance: ±5%; Voltage - Rated: 50V
CN1 = A2005WR-2X6P
D1 D4 D5 = LESD5D5.0CT1G: Bi-Directional 5V SOD-523 Electrostatic and Surge Protection; Manufacturer: Leshan Radio; Convert to PCB: yes; Origin Footprint: SOD-523_L1.2-W0.8-LS1.6-BI; Name: LESD5D5.0CT1G; Symbol: LESD5D5.0CT1G; Device: LESD5D5.0CT1G; Supplier: LCSC; Supplier Part: C383211; Manufacturer Part: LESD5D5.0CT1G; JLCPCB Part Class: Extended Part; Add into BOM: yes
J = 104642-1610: as J on sheet My4G; Package: None; SnapEDA_Link: https://www.snapeda.com/parts/104642-1610/Molex/view-part/501052/?ref=snap; Mouser-Purchase-URL: https://snapeda.com/shop?store=Mouser&id=501052; MP: 104642-1610; Price: None; Availability: Warning; Value: *
J3 = TYPEC Side Plug: MF: {'manufacturer': u'Molex'}; MP: 2169890001; Package: None; Price: None; Value: *; Availability: Unavailable
LED1-LED3 = LED: 0603LED-红，兼容直插; Manufacturer: EVERLIGHT; Name: 19-217/GHC-YR1S2/3T; Convert to PCB: yes; Origin Footprint: LED0603-R-RD; Symbol: 19-217/GHC-YR1S2/3T; Device: 19-217/GHC-YR1S2/3T; Supplier: LCSC; Manufacturer Part: 19-217/GHC-YR1S2/3T; Supplier Part: C72043; JLCPCB Part Class: Basic Part; Add into BOM: yes
P1 = Header 9: Header, 9-Pin; LatestRevisionDate: 17-Jul-2002; LatestRevisionNote: Re-released for DXP Platform.; Publisher: Altium Limited
Q2 Q3 = 2N7002: Nmos 2N7000, 2N7002, NDS7002A
R1 R5 R6 = RPC0805JT100R-UP: RES, PULSE, 0805, 5%, 100 OHM, 0; Manufacturer: Stackpole Electronics Inc; Power (Watts): 0.5W, 1/2W; Resistance: 100 Ohms; Temperature Coefficient: ±200ppm/°C; Part Number: RPC0805JT100R-UP; ComponentLink1Description: Datasheet; ComponentLink1URL: https://www.seielect.com/catalog/sei-rpc.pdf; ComponentLink2Description: DigiKey Link; ComponentLink2URL: http://digikey.com/product-detail/en/stackpole-electronics-inc/RPC0805JT100R-UP/RPC0805JT100R-UPCT-ND/10109071; Composition: Thick Film; Device Package: 0805 (2012 Metric); Features: Automotive AEC-Q200, Pulse Withstanding; Height - Seated (Max): 0.024" (0.60mm); LastUpdated: 02.09.2020 01:15:08; Lifecycle Status: Active; Minimum Order: 1; Number of Terminations: 2; Operating Temperature: -55°C ~ 155°C; Package / Case: 0805 (2012 Metric); Packaging: TapeAndReel; PartId: 35188; Part Status: Active; Price: 0.02; Ratings: AEC-Q200; Series: RPC; Size / Dimension: 0.079" L x 0.049" W (2.00mm x 1.25mm); Supplier 1: DigiKey; Supplier Part Number 1: RPC0805JT100R-UPCT-ND; Supplier Device Package: 0805; Tolerance: ±5%
R2 = RPC0805JT100R-UP: RES, PULSE, 0805, 5%, 100 OHM, 0; Manufacturer: Stackpole Electronics Inc; Value: 10k; Power (Watts): 0.5W, 1/2W; Resistance: 100 Ohms; Temperature Coefficient: ±200ppm/°C; Part Number: RPC0805JT100R-UP; ComponentLink1Description: Datasheet; ComponentLink1URL: https://www.seielect.com/catalog/sei-rpc.pdf; ComponentLink2Description: DigiKey Link; ComponentLink2URL: http://digikey.com/product-detail/en/stackpole-electronics-inc/RPC0805JT100R-UP/RPC0805JT100R-UPCT-ND/10109071; Composition: Thick Film; Device Package: 0805 (2012 Metric); Features: Automotive AEC-Q200, Pulse Withstanding; Height - Seated (Max): 0.024" (0.60mm); LastUpdated: 02.09.2020 01:15:08; Lifecycle Status: Active; Minimum Order: 1; Number of Terminations: 2; Operating Temperature: -55°C ~ 155°C; Package / Case: 0805 (2012 Metric); Packaging: TapeAndReel; PartId: 35188; Part Status: Active; Price: 0.02; Ratings: AEC-Q200; Series: RPC; Size / Dimension: 0.079" L x 0.049" W (2.00mm x 1.25mm); Supplier 1: DigiKey; Supplier Part Number 1: RPC0805JT100R-UPCT-ND; Supplier Device Package: 0805; Tolerance: ±5%
R3 R4 = 5.1K: Manufacturer: UniOhm; Manufacturer Part: 0402WGF5101TCE; Convert to PCB: yes; Origin Footprint: R0402; Name: 5.1K; Symbol: 5.1K; Device: 5.1K; Supplier: LCSC; Supplier Part: C25905; JLCPCB Part Class: Basic Part; Add into BOM: yes
R8-R10 = 2.2K: Manufacturer: UniOhm; Manufacturer Part: 0402WGF2201TCE; Convert to PCB: yes; Origin Footprint: R0402; Name: 2K/0603; Symbol: 2.2K; Device: 2.2K; Supplier: LCSC; Supplier Part: C25879; JLCPCB Part Class: Basic Part; Add into BOM: yes
R43 = 2.2K排阻-4D03: 电阻排-4D03
RF2 = BWSMA-KWE-Z001: SMA 4脚拐弯射频天线插座，https://item.taobao.com/item.htm?abbucket=8&id=645371264157&ns=1&sku_properties=1627207:22096496743&spm=a21n57.1.item.1.71b2523c1yKr0E
U3 = 24CXX: microchip 加密芯片 IIC，SOIC封装
U5 = ESP32-S2-SOLO-U-N4: RISC-V芯片或Xtensa双核芯片,wifi+BLE.腿脚兼容ESP32-S3
U10 = CH340K: usb转串口，用于下载使用。

## Nets that join several sheets
GND: POWER (9 pins), My4G (23 pins), RS485 (5 pins), CANBUS (C41.1 D3.3 R41.1 U7.2), MCU (32 pins)
VCC33: POWER (U1.5), My4G (U8.7), RS485 (C43.2 C44.2 R39.2 U6.8), CANBUS (C41.2 U7.3), MCU (19 pins)
VCC42: POWER (8 pins), My4G (U4.34 U4.35)
CAN0_H: CANBUS (D3.1 J2.2 U7.7), MCU (CN1.10)
CAN0_L: CANBUS (D3.2 R42.1 U7.6), MCU (CN1.12)
CAN0_RS: CANBUS (R41.2 U7.8), MCU (U5.30)
CAN0_RX: CANBUS (U7.4), MCU (U5.29)
CAN0_TX: CANBUS (U7.1), MCU (U5.28)
PWRKEY: My4G (R11.1), MCU (U5.12)
RS485A: RS485 (D2.2 J1.1 R39.1 U6.6), MCU (CN1.2)
RS485B: RS485 (D2.1 R7.1 R36.2 U6.7), MCU (CN1.4)
RS485DRE: RS485 (U6.2 U6.3), MCU (U5.35)
RS485RXD: RS485 (U6.1), MCU (U5.39)
RS485TXD: RS485 (U6.4), MCU (U5.38)
RXDMCU: My4G (U8.1), MCU (U5.8)
TXDMCU: My4G (U8.8), MCU (U5.9)
USB5V: POWER (C21.1 C22.1 R18.1 U2.3), MCU (5 pins)
USBDN: My4G (U4.26), MCU (U5.13)
USBDP: My4G (U4.25), MCU (U5.14)